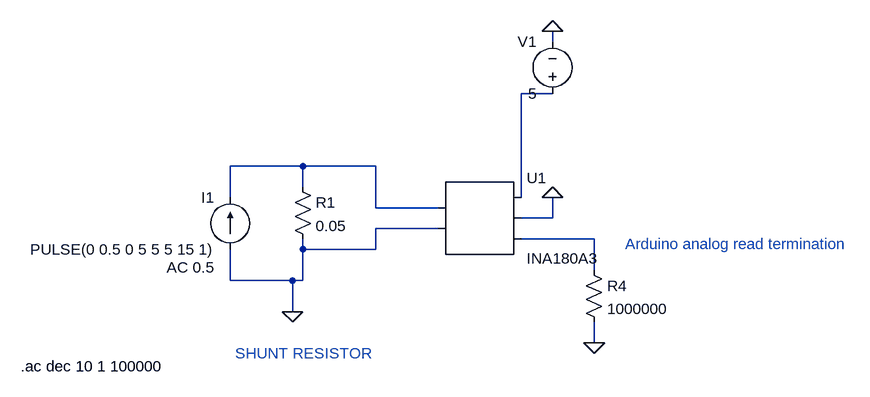
[diagram p0: schematic Current sensing circuit.asc]
Current sensing circuit.asc, the LTspice schematic file:
Version 4
SHEET 1 1780 680
WIRE 576 -80 576 -96
WIRE 576 0 528 0
WIRE 192 112 80 112
WIRE 304 112 192 112
WIRE 192 144 192 112
WIRE 80 160 80 112
WIRE 528 160 528 0
WIRE 304 176 304 112
WIRE 400 176 304 176
WIRE 576 192 576 160
WIRE 576 192 528 192
WIRE 400 208 304 208
WIRE 640 224 528 224
WIRE 192 240 192 224
WIRE 304 240 304 208
WIRE 304 240 192 240
WIRE 640 272 640 224
WIRE 80 288 80 240
WIRE 176 288 80 288
WIRE 192 288 192 240
WIRE 192 288 176 288
WIRE 176 336 176 288
WIRE 640 384 640 352
FLAG 576 -96 0
FLAG 640 384 0
FLAG 176 336 0
FLAG 576 160 0
SYMBOL voltage 576 16 R180
WINDOW 0 24 96 Left 2
WINDOW 3 24 16 Left 2
WINDOW 123 0 0 Left 0
WINDOW 39 0 0 Left 0
SYMATTR InstName V1
SYMATTR Value 5
SYMBOL res 624 256 R0
SYMATTR InstName R4
SYMATTR Value 1000000
SYMBOL res 176 128 R0
SYMATTR InstName R1
SYMATTR Value 0.05
SYMBOL AutoGenerated\\INA180A3 464 192 R0
SYMATTR InstName U1
SYMBOL current 80 240 R180
WINDOW 0 24 80 Left 2
WINDOW 3 24 0 Left 2
WINDOW 123 24 -28 Left 2
WINDOW 39 0 0 Left 0
SYMATTR InstName I1
SYMATTR Value PULSE(0 0.5 0 5 5 5 15 1)
SYMATTR Value2 AC 0.5
TEXT 88 400 Left 2 ;SHUNT RESISTOR
TEXT 688 232 Left 2 ;Arduino analog read termination
TEXT -242 420 Left 2 !.ac dec 10 1 100000

The netlist it stands for:
* Current sensing circuit.asc
V1 N001 0 5
R4 N003 0 1000000
R1 N002 0 0.05
* U1: INA180A3 (symbol AutoGenerated\INA180A3 not available, pins judged from their places): pin1=N002 pin2=0 pin3=N001 pin4=0 pin5=N003
I1 0 N002 PULSE(0 0.5 0 5 5 5 15 1) AC 0.5
* SHUNT RESISTOR
* Arduino analog read termination
.ac dec 10 1 100000
.backanno
.end